# Altium schematic sheet WanderDrive_EtherCAT.SchDoc
size A2; Date: Not shown in title block; ApprovedBy: Not shown in title block; CheckedBy: Not shown in title block; Author: Not shown in title block; CompanyName: Not shown in title block; Engineer: Not shown in title block; Organization: Not shown in title block; Address1: Not shown in title block; Address2: Not shown in title block; Address3: Not shown in title block; Address4: Not shown in title block; DocumentNumber: 8; Revision: Use project parameter SCH_Rev; SheetNumber: 8; SheetTotal: 11; PageSetup: Record=PageOptions|CenterHorizontal=True|CenterVertical=True|PrintScale=1.00|XCorrection=1.00|YCorrection=1.00|PrintKind=0|BorderSize=5000000|LeftOffset=0|BottomOffset=0|Orientation=2|PaperLength=1000|PaperWidth=1000|Scale=100|PaperSource=15|PrintQuality=600|MediaType=1|DitherType=10|PaperKind=Letter|PrintScaleMode=1; CurrentTime: Not shown in title block; CurrentDate: Not shown in title block; Time: Not shown in title block; DocumentFullPathAndName: Not shown in title block; DocumentName: Not shown in title block; ModifiedDate: Not shown in title block; ImagePath: Not shown in title block
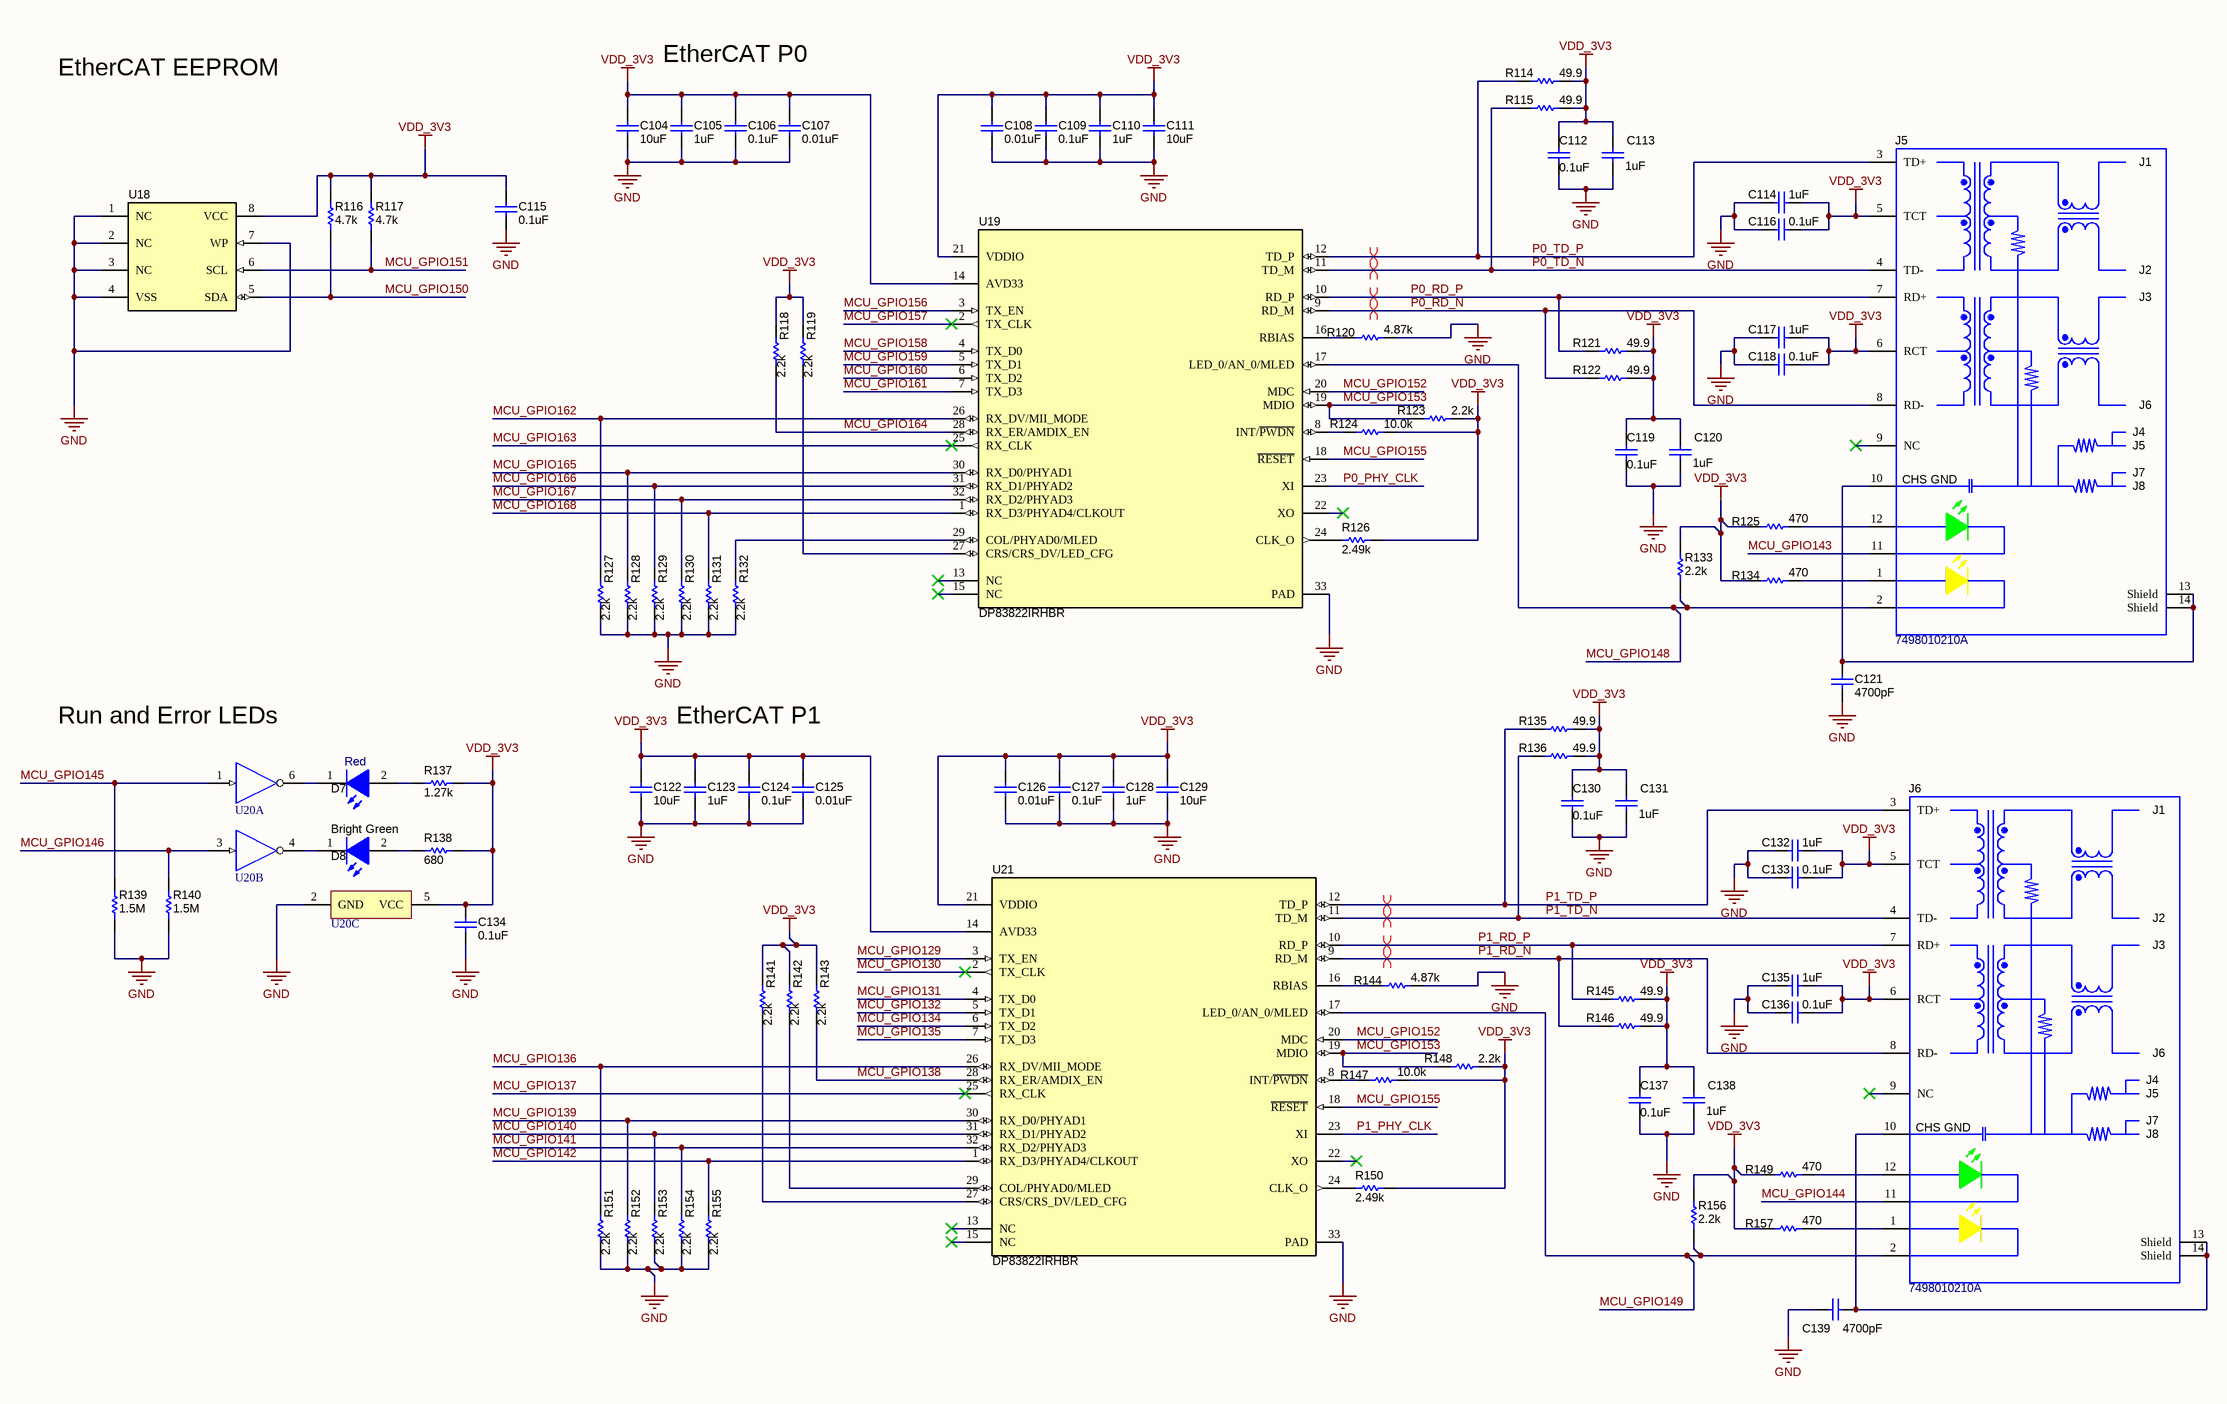
[diagram p0: WanderDrive_EtherCAT.SchDoc]

## Parts
C104  ValueDisplayed: 10uF  [0402]  (hidden comment: CL05A106MQ5NUNC)
C105  ValueDisplayed: 1uF  [0402]  (hidden comment: EMK105BJ105KVHF)
C106  ValueDisplayed: 0.1uF  [0402]  (hidden comment: LMK105BJ104KV-F)
C107  ValueDisplayed: 0.01uF  [0402]  (hidden comment: 885012205031)
C108  ValueDisplayed: 0.01uF  [0402]  (hidden comment: 885012205031)
C109  ValueDisplayed: 0.1uF  [0402]  (hidden comment: LMK105BJ104KV-F)
C110  ValueDisplayed: 1uF  [0402]  (hidden comment: EMK105BJ105KVHF)
C111  ValueDisplayed: 10uF  [0402]  (hidden comment: CL05A106MQ5NUNC)
C112  ValueDisplayed: 0.1uF  [0402]  (hidden comment: LMK105BJ104KV-F)
C113  ValueDisplayed: 1uF  [0402]  (hidden comment: EMK105BJ105KVHF)
C114  ValueDisplayed: 1uF  [0402]  (hidden comment: EMK105BJ105KVHF)
C115  ValueDisplayed: 0.1uF  [0402]  (hidden comment: CL05B104KP5NNNC)
C116  ValueDisplayed: 0.1uF  [0402]  (hidden comment: LMK105BJ104KV-F)
C117  ValueDisplayed: 1uF  [0402]  (hidden comment: EMK105BJ105KVHF)
C118  ValueDisplayed: 0.1uF  [0402]  (hidden comment: LMK105BJ104KV-F)
C119  ValueDisplayed: 0.1uF  [0402]  (hidden comment: LMK105BJ104KV-F)
C120  ValueDisplayed: 1uF  [0402]  (hidden comment: EMK105BJ105KVHF)
C121  ValueDisplayed: 4700pF  [1206]  (hidden comment: 12061C472KAT2A)
C122  ValueDisplayed: 10uF  [0402]  (hidden comment: CL05A106MQ5NUNC)
C123  ValueDisplayed: 1uF  [0402]  (hidden comment: EMK105BJ105KVHF)
C124  ValueDisplayed: 0.1uF  [0402]  (hidden comment: LMK105BJ104KV-F)
C125  ValueDisplayed: 0.01uF  [0402]  (hidden comment: 885012205031)
C126  ValueDisplayed: 0.01uF  [0402]  (hidden comment: 885012205031)
C127  ValueDisplayed: 0.1uF  [0402]  (hidden comment: LMK105BJ104KV-F)
C128  ValueDisplayed: 1uF  [0402]  (hidden comment: EMK105BJ105KVHF)
C129  ValueDisplayed: 10uF  [0402]  (hidden comment: CL05A106MQ5NUNC)
C130  ValueDisplayed: 0.1uF  [0402]  (hidden comment: LMK105BJ104KV-F)
C131  ValueDisplayed: 1uF  [0402]  (hidden comment: EMK105BJ105KVHF)
C132  ValueDisplayed: 1uF  [0402]  (hidden comment: EMK105BJ105KVHF)
C133  ValueDisplayed: 0.1uF  [0402]  (hidden comment: LMK105BJ104KV-F)
C134  ValueDisplayed: 0.1uF  [0402]  (hidden comment: CL05B104KP5NNNC)
C135  ValueDisplayed: 1uF  [0402]  (hidden comment: EMK105BJ105KVHF)
C136  ValueDisplayed: 0.1uF  [0402]  (hidden comment: LMK105BJ104KV-F)
C137  ValueDisplayed: 0.1uF  [0402]  (hidden comment: LMK105BJ104KV-F)
C138  ValueDisplayed: 1uF  [0402]  (hidden comment: EMK105BJ105KVHF)
C139  ValueDisplayed: 4700pF  [1206]  (hidden comment: 12061C472KAT2A)
D7  value Red  [WL-SMCW_RED_0805]  (hidden comment: 150080SS75000)
D8  value Bright Green  [WL-SMCW_Green_0805]  (hidden comment: 150080VS75000)
J5  7498010210A  [Wurth_7498010210A]
J6  7498010210A  [Wurth_7498010210A]
R114  ValueDisplayed: 49.9  [0402]  (hidden comment: RC0402FR-0749R9L)
R115  ValueDisplayed: 49.9  [0402]  (hidden comment: RC0402FR-0749R9L)
R116  ValueDisplayed: 4.7k  [0402]  (hidden comment: CRCW04024K70JNED)
R117  ValueDisplayed: 4.7k  [0402]  (hidden comment: CRCW04024K70JNED)
R118  ValueDisplayed: 2.2k  [0201]  (hidden comment: CRCW02012K20JNED)
R119  ValueDisplayed: 2.2k  [0201]  (hidden comment: CRCW02012K20JNED)
R120  ValueDisplayed: 4.87k  [0402]  (hidden comment: CRCW04024K87FKED)
R121  ValueDisplayed: 49.9  [0402]  (hidden comment: RC0402FR-0749R9L)
R122  ValueDisplayed: 49.9  [0402]  (hidden comment: RC0402FR-0749R9L)
R123  ValueDisplayed: 2.2k  [0402]  (hidden comment: CRCW04022K20JNED)
R124  ValueDisplayed: 10.0k  [0402]  (hidden comment: RC0402FR-0710KL)
R125  ValueDisplayed: 470  [0603]  (hidden comment: CRCW0603470RJNEA)
R126  ValueDisplayed: 2.49k  [0402]  (hidden comment: CRCW04022K49FKED)
R127  ValueDisplayed: 2.2k  [0201]  (hidden comment: CRCW02012K20JNED)
R128  ValueDisplayed: 2.2k  [0201]  (hidden comment: CRCW02012K20JNED)
R129  ValueDisplayed: 2.2k  [0201]  (hidden comment: CRCW02012K20JNED)
R130  ValueDisplayed: 2.2k  [0201]  (hidden comment: CRCW02012K20JNED)
R131  ValueDisplayed: 2.2k  [0201]  (hidden comment: CRCW02012K20JNED)
R132  ValueDisplayed: 2.2k  [0201]  (hidden comment: CRCW02012K20JNED)
R133  ValueDisplayed: 2.2k  [0402]  (hidden comment: CRCW04022K20JNED)
R134  ValueDisplayed: 470  [0603]  (hidden comment: CRCW0603470RJNEA)
R135  ValueDisplayed: 49.9  [0402]  (hidden comment: RC0402FR-0749R9L)
R136  ValueDisplayed: 49.9  [0402]  (hidden comment: RC0402FR-0749R9L)
R137  ValueDisplayed: 1.27k  [0402]  (hidden comment: CRCW04021K27FKED)
R138  ValueDisplayed: 680  [0402]  (hidden comment: CRCW0402680RJNED)
R139  ValueDisplayed: 1.5M  [0402]  (hidden comment: CRCW04021M50JNED)
R140  ValueDisplayed: 1.5M  [0402]  (hidden comment: CRCW04021M50JNED)
R141  ValueDisplayed: 2.2k  [0201]  (hidden comment: CRCW02012K20JNED)
R142  ValueDisplayed: 2.2k  [0201]  (hidden comment: CRCW02012K20JNED)
R143  ValueDisplayed: 2.2k  [0201]  (hidden comment: CRCW02012K20JNED)
R144  ValueDisplayed: 4.87k  [0402]  (hidden comment: CRCW04024K87FKED)
R145  ValueDisplayed: 49.9  [0402]  (hidden comment: RC0402FR-0749R9L)
R146  ValueDisplayed: 49.9  [0402]  (hidden comment: RC0402FR-0749R9L)
R147  ValueDisplayed: 10.0k  [0402]  (hidden comment: RC0402FR-0710KL)
R148  ValueDisplayed: 2.2k  [0402]  (hidden comment: CRCW04022K20JNED)
R149  ValueDisplayed: 470  [0603]  (hidden comment: CRCW0603470RJNEA)
R150  ValueDisplayed: 2.49k  [0402]  (hidden comment: CRCW04022K49FKED)
R151  ValueDisplayed: 2.2k  [0201]  (hidden comment: CRCW02012K20JNED)
R152  ValueDisplayed: 2.2k  [0201]  (hidden comment: CRCW02012K20JNED)
R153  ValueDisplayed: 2.2k  [0201]  (hidden comment: CRCW02012K20JNED)
R154  ValueDisplayed: 2.2k  [0201]  (hidden comment: CRCW02012K20JNED)
R155  ValueDisplayed: 2.2k  [0201]  (hidden comment: CRCW02012K20JNED)
R156  ValueDisplayed: 2.2k  [0402]  (hidden comment: CRCW04022K20JNED)
R157  ValueDisplayed: 470  [0603]  (hidden comment: CRCW0603470RJNEA)
U18  CAT24C16WI-GT3  [SOIC-8]  (value not drawn)
U19  DP83822IRHBR  [RHB0032B]
U20  SN74LVC2G06DBVR  [DBV0006A_N]  (value not drawn)  (parts A,B,C of 3)
U21  DP83822IRHBR  [RHB0032B]

## Nets
GND: C104.2 C105.2 C106.2 C107.2 C108.2 C109.2 C110.2 C111.2 C112.2 C113.2 C114.1 C115.2 C116.1 C117.1 C118.1 C119.2 C120.2 C121.1 C122.2 C123.2 C124.2 C125.2 C126.2 C127.2 C128.2 C129.2 C130.2 C131.2 C132.1 C133.1 C134.2 C135.1 C136.1 C137.2 C138.2 C139.1 R120.2 R127.1 R128.1 R129.1 R130.1 R131.1 R132.1 R139.2 R140.2 R144.2 R151.1 R152.1 R153.1 R154.1 R155.1 U18.1(NC) U18.2(NC) U18.3(NC) U18.4(VSS) U18.7(WP) U19.33(PAD) U20.2(GND) U21.33(PAD)
VDD_3V3: C104.1 C105.1 C106.1 C107.1 C108.1 C109.1 C110.1 C111.1 C112.1 C113.1 C114.2 C115.1 C116.2 C117.2 C118.2 C119.1 C120.1 C122.1 C123.1 C124.1 C125.1 C126.1 C127.1 C128.1 C129.1 C130.1 C131.1 C132.2 C133.2 C134.1 C135.2 C136.2 C137.1 C138.1 J5.5(TCT) J5.6(RCT) J6.5(TCT) J6.6(RCT) R114.2 R115.2 R116.2 R117.2 R118.2 R119.2 R121.2 R122.2 R123.1 R124.2 R125.1 R126.1 R133.2 R134.1 R135.2 R136.2 R137.2 R138.1 R141.2 R142.2 R143.2 R145.2 R146.2 R147.2 R148.1 R149.1 R150.1 R156.2 R157.1 U18.8(VCC) U19.14(AVD33) U19.21(VDDIO) U20.5(VCC) U21.14(AVD33) U21.21(VDDIO)
MCU_GPIO129: U21.3(TX_EN)
MCU_GPIO130: U21.2(TX_CLK)
MCU_GPIO131: U21.4(TX_D0)
MCU_GPIO132: U21.5(TX_D1)
MCU_GPIO134: U21.6(TX_D2)
MCU_GPIO135: U21.7(TX_D3)
MCU_GPIO136: R151.2 U21.26(RX_DV/MII_MODE)
MCU_GPIO137: U21.25(RX_CLK)
MCU_GPIO138: R143.1 U21.28(RX_ER/AMDIX_EN)
MCU_GPIO139: R152.2 U21.30(RX_D0/PHYAD1)
MCU_GPIO140: R153.2 U21.31(RX_D1/PHYAD2)
MCU_GPIO141: R154.2 U21.32(RX_D2/PHYAD3)
MCU_GPIO142: R155.2 U21.1(RX_D3/PHYAD4/CLKOUT)
MCU_GPIO143: J5.11(LEFT_LED_CATHODE)
MCU_GPIO144: J6.11(LEFT_LED_CATHODE)
MCU_GPIO145: R139.1 U20.1(1A)
MCU_GPIO146: R140.1 U20.3(2A)
MCU_GPIO148: J5.2(RIGHT_LED_CATHODE) R133.1 U19.17(LED_0/AN_0/MLED)
MCU_GPIO149: J6.2(RIGHT_LED_CATHODE) R156.1 U21.17(LED_0/AN_0/MLED)
MCU_GPIO150: R116.1 U18.5(SDA)
MCU_GPIO151: R117.1 U18.6(SCL)
MCU_GPIO152: U19.20(MDC) U21.20(MDC)
MCU_GPIO153: R123.2 R148.2 U19.19(MDIO) U21.19(MDIO)
MCU_GPIO155: U19.18(~{RESET}) U21.18(~{RESET})
MCU_GPIO156: U19.3(TX_EN)
MCU_GPIO157: U19.2(TX_CLK)
MCU_GPIO158: U19.4(TX_D0)
MCU_GPIO159: U19.5(TX_D1)
MCU_GPIO160: U19.6(TX_D2)
MCU_GPIO161: U19.7(TX_D3)
MCU_GPIO162: R127.2 U19.26(RX_DV/MII_MODE)
MCU_GPIO163: U19.25(RX_CLK)
MCU_GPIO164: R118.1 U19.28(RX_ER/AMDIX_EN)
MCU_GPIO165: R128.2 U19.30(RX_D0/PHYAD1)
MCU_GPIO166: R129.2 U19.31(RX_D1/PHYAD2)
MCU_GPIO167: R130.2 U19.32(RX_D2/PHYAD3)
MCU_GPIO168: R131.2 U19.1(RX_D3/PHYAD4/CLKOUT)
P0_PHY_CLK: U19.23(XI)
P0_RD_N: J5.8(RD-) R122.1 U19.9(RD_M)
P0_RD_P: J5.7(RD+) R121.1 U19.10(RD_P)
P0_TD_N: J5.4(TD-) R115.1 U19.11(TD_M)
P0_TD_P: J5.3(TD+) R114.1 U19.12(TD_P)
P1_PHY_CLK: U21.23(XI)
P1_RD_N: J6.8(RD-) R146.1 U21.9(RD_M)
P1_RD_P: J6.7(RD+) R145.1 U21.10(RD_P)
P1_TD_N: J6.4(TD-) R136.1 U21.11(TD_M)
P1_TD_P: J6.3(TD+) R135.1 U21.12(TD_P)
NetC121_2: C121.2 J5.10(CHS_GND) J5.13(Shield) J5.14(Shield)
NetC139_2: C139.2 J6.10(CHS_GND) J6.13(Shield) J6.14(Shield)
NetD7_1: D7.1(K) U20.6(1Y)
NetD7_2: D7.2(A) R137.1
NetD8_1: D8.1(K) U20.4(2Y)
NetD8_2: D8.2(A) R138.2
NetJ5_1: J5.1(RIGHT_LED_ANODE) R134.2
NetJ5_12: J5.12(LEFT_LED_ANODE) R125.2
NetJ6_1: J6.1(RIGHT_LED_ANODE) R157.2
NetJ6_12: J6.12(LEFT_LED_ANODE) R149.2
NetR119_1: R119.1 U19.27(CRS/CRS_DV/LED_CFG)
NetR120_1: R120.1 U19.16(RBIAS)
NetR124_1: R124.1 U19.8(INT/~{PWDN})
NetR126_2: R126.2 U19.24(CLK_O)
NetR132_2: R132.2 U19.29(COL/PHYAD0/MLED)
NetR141_1: R141.1 U21.27(CRS/CRS_DV/LED_CFG)
NetR142_1: R142.1 U21.29(COL/PHYAD0/MLED)
NetR144_1: R144.1 U21.16(RBIAS)
NetR147_1: R147.1 U21.8(INT/~{PWDN})
NetR150_2: R150.2 U21.24(CLK_O)

Not connected (* = marked no-connect by the designer): J5 9(NC)*; J6 9(NC)*; U19 13(NC)* 15(NC)* 22(XO)*; U21 13(NC)* 15(NC)* 22(XO)*

## Layout directives
differential pair: P0_RD_N, P0_RD_P, P0_TD_N, P0_TD_P, P1_RD_N, P1_RD_P, P1_TD_N, P1_TD_P

## Notes on the sheet
- EtherCAT EEPROM
- EtherCAT P0
- Run and Error LEDs
- EtherCAT P1
- Title
- Size:
- Date:
- File:
- A2
- Number:
- Time:
- Revision:
- Sheet
- of
- (in symbol CMP-0086350-1) J1; J2; J3; J6; J4; J7; J8; J5

## Library data of the parts
C104 C111 C122 C129 = CMP-0006340-2: CAP, CERM, 10 uF, 6.3 V, +/- 20%, X5R, 0402; Manufacturer: Samsung Electro-Mechanics; TaMin_C: -55°C; Polarized: N; SizeAreaWB_mm2: 3; Value1: Unknown; U/M: EA; Value: 10uF; TaMax_C: 85°C; SizeZ_mm: 0.6; SizeX_mm: 1; SizeY_mm: 0.5; Value2: 6.3V; Cap_F: 10µF; AEC Category: Q200; Publisher: Texas Instruments; TempCo: X5R; Published: 2008-06-19; RoHS: Y; MountType: SMT; PackageReference: 0402; Tolerance_%: 20%; Cap_Case: 0402; SizeArea_mm2: 0.5; CompType: Capacitor; LatestRevisionDate: 2017-03-09; PartNumber: CL05A106MQ5NUNC; AEC Qualified: ?; ComponentLink1Description: Datasheet link; Technology: Ceramic; ComponentLink1URL: http://www.samsungsem.com/servlet/DownloadServlet?dir=partnumber&num=&fileName=CL05A106MQ5NUNC.pdf
C105 C110 C113 C114 C117 C120 C123 C128 C131 C132 C135 C138 = CMP-0006347-2: CAP, CERM, 1 uF, 16 V, +/- 10%, X5R, 0402; Manufacturer: Taiyo Yuden; TaMin_C: -55°C; Polarized: N; SizeAreaWB_mm2: 3; Value1: Unknown; U/M: EA; Value: 1uF; TaMax_C: 85°C; SizeZ_mm: 0.6; SizeX_mm: 1; SizeY_mm: 0.5; Value2: 16V; Cap_F: 1µF; AEC Category: Q200; Supplier Part Number 2: 68X1293; Publisher: Texas Instruments; Supplier 2: Newark; TempCo: X5R; Published: 2008-06-19; RoHS: Y; MountType: SMT; Supplier 1: Digi-Key; PackageReference: 0402; Tolerance_%: 10%; Cap_Case: 0402; SizeArea_mm2: 0.5; CompType: Capacitor; LatestRevisionDate: 2017-03-09; PartNumber: EMK105BJ105KVHF; AEC Qualified: ?; ComponentLink1Description: Datasheet link; Supplier Part Number 1: 587-3709-2-ND; Technology: Ceramic; ComponentLink1URL: http://www.yuden.co.jp/ut/product/category/capacitor/EMK105BJ105KVHF_SS.pdf
C106 C109 C112 C116 C118 C119 C124 C127 C130 C133 C136 C137 = CMP-0064930-2: CAP, CERM, 0.1 uF, 10 V,+/- 10%, X5R, 0402; Manufacturer: Taiyo Yuden; TaMin_C: -55°C; Polarized: N; SizeAreaWB_mm2: 3; Value1: Unknown; U/M: EA; Value: 0.1uF; TaMax_C: 85°C; SizeZ_mm: 0.6; SizeX_mm: 1; SizeY_mm: 0.5; Value2: 10V; Cap_F: 100nF; AEC Category: Q200; Supplier Part Number 2: 86H5618; Publisher: Texas Instruments; Supplier 2: Newark; Supplier Part Number 3: 963-LMK105BJ104KV-F; TempCo: X5R; Supplier 3: Mouser; Published: 2008-06-19; RoHS: Y; MountType: SMT; Supplier 1: Digi-Key; PackageReference: 0402; Tolerance_%: 10%; Cap_Case: 0402; SizeArea_mm2: 0.5; CompType: Capacitor; LatestRevisionDate: 2017-06-05; PartNumber: LMK105BJ104KV-F; AEC Qualified: N; ComponentLink1Description: Datasheet link; AEC Grade: N/A; Supplier Part Number 1: 587-1227-1-ND; Technology: Ceramic; ComponentLink1URL: http://ds.yuden.co.jp/TYCOMPAS/ut/detail.do?productNo=LMK105BJ104KV-F&fileName=LMK105BJ104KV-F_SS&mode=specSheetDownload; VDC_V: 10V
C107 C108 C125 C126 = CMP-0006227-2: CAP, CERM, 0.01 uF, 16 V, +/- 10%, X7R, 0402; Manufacturer: Wurth Elektronik; TaMin_C: -55°C; Polarized: N; SizeAreaWB_mm2: 3; Value1: Unknown; U/M: EA; Value: 0.01uF; TaMax_C: 125°C; SizeZ_mm: 0.6; SizeX_mm: 1; SizeY_mm: 0.5; Value2: 16V; Cap_F: 10nF; AEC Category: Q200; Publisher: Texas Instruments; TempCo: X7R; Published: 2008-06-19; RoHS: Y; MountType: SMT; Supplier 1: Mouser; PackageReference: 0402; Tolerance_%: 10%; Cap_Case: 0402; SizeArea_mm2: 0.5; CompType: Capacitor; LatestRevisionDate: 2017-03-09; PartNumber: 885012205031; AEC Qualified: N; ComponentLink1Description: Datasheet link; AEC Grade: N/A; Supplier Part Number 1: 710-885012205031; Technology: Ceramic; ComponentLink1URL: http://katalog.we-online.de/pbs/datasheet/885012205031.pdf
C115 C134 = CMP-0006343-2: CAP, CERM, 0.1 uF, 10 V, +/- 10%, X7R, 0402; Manufacturer: Samsung Electro-Mechanics; Polarized: N; Value: 0.1uF; U/M: EA; Cap_F: 100nF; Value1: Unknown; VDC_V: 10V; TaMin_C: -55°C; TaMax_C: 125°C; AEC Category: Q200; SizeArea_mm2: 0.5; SizeAreaWB_mm2: 3; SizeX_mm: 1; SizeZ_mm: 0.6; CompType: Capacitor; PartNumber: CL05B104KP5NNNC; PackageReference: 0402; RoHS: Y; Tolerance_%: 10%; Value2: 10V; MountType: SMT; Technology: Ceramic; TempCo: X7R; Cap_Case: 0402; Published: 2008-06-19; Publisher: Texas Instruments; LatestRevisionDate: 2017-03-09; ComponentLink1Description: Datasheet link; ComponentLink1URL: http://www.samsungsem.com/kr/front/downloadcms.do?path=/kr/support/product-search/mlcc/__icsFiles/afieldfile/2014/11/05&fileName=S_CL05B104KP5NNNC.pdf; AEC Qualified: N; AEC Grade: N/A; SizeY_mm: 0.5
C121 C139 = CMP-0008501-2: CAP, CERM, 4700 pF, 100 V, +/- 10%, X7R, 1206; Manufacturer: AVX; TaMin_C: -55°C; ESR_ohm: 1.78d; Polarized: N; SizeAreaWB_mm2: 10.92; Value1: 0.178 ohm; U/M: EA; Value: 4700pF; TaMax_C: 125°C; SizeZ_mm: 1.35; SizeX_mm: 3.2; SizeY_mm: 1.6; Value2: 100V; SizeArea_mm2: 5.12; Cap_F: 4.7nF; AEC Category: Q200; Supplier Part Number 2: 96M1479; Publisher: Texas Instruments; Supplier 2: Newark; Supplier Part Number 3: 581-12061C472K; TempCo: X7R; Supplier 3: Mouser; Published: 2008-06-19; RoHS: Y; MountType: SMT; Supplier 1: Digi-Key; PackageReference: 1206; Tolerance_%: 10%; Cap_Case: 1206; CompType: Capacitor; LatestRevisionDate: 2017-03-09; PartNumber: 12061C472KAT2A; AEC Qualified: N; ComponentLink1Description: Datasheet link; AEC Grade: N/A; Supplier Part Number 1: 478-1521-1-ND; Technology: Ceramic; ComponentLink1URL: http://datasheets.avx.com/X7RDielectric.pdf
D7 = CMP-0002951-3: LED, Red, SMD; Manufacturer: Wurth Elektronik; Type: AlInGaP; Vf_V: 1.9V; Io_A: 30mA; Vr_V: 5V; Ir_A: 25µA; Tjmax_C: 85°C; Power_TotalModule: 72mW; Value1: 0.072W; Angle: 140; PartNumber: 150080SS75000; PackageReference: LED_0805; RoHS: Y; CompType: LED; MountType: SMT; Value2: 1.9V; Color: Red; ComponentLink1URL: http://katalog.we-online.de/led/datasheet/150080SS75000.pdf; ComponentLink1Description: Datasheet link
D8 = CMP-0002960-2: LED, Bright Green, SMD; Manufacturer: Wurth Elektronik; Type: AlInGaP; Vf_V: 2V; Io_A: 20mA; Vr_V: 5V; Tjmax_C: 85°C; Power_TotalModule: 72mW; Value1: 0.072W; Angle: 140; U/M: EA; PartNumber: 150080VS75000; PackageReference: LED_0805; RoHS: Y; CompType: LED; MountType: SMT; Value2: 2V; Color: Bright Green; Published: 2008-07-11; Publisher: Texas Instruments; ComponentLink1URL: http://katalog.we-online.de/led/datasheet/150080VS75000.pdf; ComponentLink1Description: Datasheet link; LatestRevisionDate: 2017-03-09; Supplier 1: Digi-Key; Supplier Part Number 1: 732-4986-1-ND; Supplier 2: Newark; Supplier Part Number 2: 95W3803; Supplier 3: Mouser; Supplier Part Number 3: 710-150080VS75000
J5 J6 = CMP-0086350-1: Connector, RJ45, 1x1, Gold, R/A, SMT; Manufacturer: Wurth Elektronik; Row_Count: 1; Gender: Female; ComponentLink1URL: https://sps16.itg.ti.com/sites/KMS/crossdivteams/altium/docs/ComponentDatasheets/7498010210A.pdf; ContactFinish: Gold; MountType: SMT; PinCount: 12; RoHS: Y; PackageReference: Connector, RJ45, 1x1, Gold, R/A, SMT; ComponentLink1Description: Datasheet URL; Orientation: R/A; CompType: RJ45; PartNumber: 7498010210A
R114 R115 R121 R122 R135 R136 R145 R146 = CMP-0026738-1: RES, 49.9, 1%, 0.063 W, 0402; Manufacturer: Yageo America; Power_W: 63mW; TempCo: 100 ppm/C; Value_Code: 49R9; U/M: EA; Value: 49.9; EIA_Code: E96; SizeX_mm: 1; SizeY_mm: 0.5; SizeZ_mm: 0.6; Value2: 0.063W; AEC Qualified: N; VDC_V: 50V; AEC Category: Q200; ComponentLink1URL: http://www.yageo.com/documents/recent/PYu-RC_Group_51_RoHS_L_1.pdf; Supplier Part Number 2: 67R9942; Publisher: Texas Instruments; Supplier 2: Newark; Supplier Part Number 3: 603-RC0402FR-0749R9L; Supplier 3: Mouser; Published: 2008-06-26; RoHS: Y; Value1: 1%; MountType: SMT; Supplier 1: Digi-Key; PackageReference: 0402; Tolerance_%: 1%; Res_ohm: 49.9; SizeArea_mm2: 0.5; CompType: Resistor; LatestRevisionDate: 2017-03-09; PartNumber: RC0402FR-0749R9L; ComponentLink1Description: Datasheet link; AEC Grade: N/A; Supplier Part Number 1: 311-49.9LRCT-ND; Technology: Thick Film
R116 R117 = CMP-0026938-5: RES, 4.7 k, 5%, 0.063 W, AEC-Q200 Grade 0, 0402; Manufacturer: Vishay-Dale; Power_W: 63mW; TempCo: 200 ppm/C; Value_Code: 4k70; Value: 4.7k; EIA_Code: E24; SizeX_mm: 1; SizeY_mm: 0.5; SizeZ_mm: 0.6; Value2: 0.063W; AEC Qualified: Y; VDC_V: 50V; AEC Category: Q200; AEC Grade: 0; Supplier Part Number 2: 59M6733; Supplier 2: Newark; Supplier Part Number 3: 71-CRCW0402J-4.7K-E3; Supplier 3: Mouser; RoHS: E; Value1: 5%; MountType: SMT; Supplier 1: Digi-Key; PackageReference: 0402; Tolerance_%: 5%; Res_ohm: 4.7k; SizeArea_mm2: 0.5; CompType: Resistor; PartNumber: CRCW04024K70JNED; ComponentLink1Description: Datasheet link; Supplier Part Number 1: 541-4.7KJCT-ND; Technology: Thick Film; ComponentLink1URL: http://www.vishay.com/docs/20035/dcrcwe3.pdf
R118 R119 R127-R132 R141-R143 R151-R155 = CMP-0027010-2: RES, 2.2 k, 5%, 0.05 W, 0201; Manufacturer: Vishay-Dale; Power_W: 50mW; TempCo: 200 ppm/C; Value_Code: 2k20; Value: 2.2k; EIA_Code: E24; SizeX_mm: 0.6; SizeY_mm: 0.3; SizeZ_mm: 0.26; Value2: 0.05W; SizeArea_mm2: 0.18; AEC Qualified: N; VDC_V: 30V; AEC Category: Q200; ComponentLink1URL: http://www.vishay.com/docs/20052/crcw0201e3.pdf; Supplier Part Number 2: 48P7324; Supplier 2: Newark; Supplier Part Number 3: 71-CRCW02012K20JNED; Supplier 3: Mouser; RoHS: E; Value1: 5%; MountType: SMT; Supplier 1: Digi-Key; PackageReference: 0201; Tolerance_%: 5%; Res_ohm: 2.2k; CompType: Resistor; PartNumber: CRCW02012K20JNED; ComponentLink1Description: Datasheet link; AEC Grade: N/A; Supplier Part Number 1: 541-2.2KAGCT-ND; Technology: Thick Film
R120 R144 = CMP-0026413-2: RES, 4.87 k, 1%, 0.063 W, AEC-Q200 Grade 0, 0402; Manufacturer: Vishay-Dale; Power_W: 63mW; TempCo: 100 ppm/C; Value_Code: 4k87; Value: 4.87k; EIA_Code: E96; SizeX_mm: 1; SizeY_mm: 0.5; SizeZ_mm: 0.6; Value2: 0.063W; AEC Qualified: Y; VDC_V: 50V; AEC Category: Q200; AEC Grade: 0; ComponentLink1URL: http://www.vishay.com/docs/20035/dcrcwe3.pdf; Supplier Part Number 2: 52K7047; Supplier 2: Newark; Supplier Part Number 3: 71-CRCW0402-4.87K-E3; Supplier 3: Mouser; RoHS: E; Value1: 1%; MountType: SMT; Supplier 1: Digi-Key; PackageReference: 0402; Tolerance_%: 1%; Res_ohm: 4.87k; SizeArea_mm2: 0.5; CompType: Resistor; PartNumber: CRCW04024K87FKED; ComponentLink1Description: Datasheet link; Supplier Part Number 1: 541-4.87KLCT-ND; Technology: Thick Film
R123 R133 R148 R156 = CMP-0026890-5: RES, 2.2 k, 5%, 0.063 W, AEC-Q200 Grade 0, 0402; Manufacturer: Vishay-Dale; Power_W: 63mW; TempCo: 200 ppm/C; Value_Code: 2k20; Value: 2.2k; EIA_Code: E24; SizeX_mm: 1; SizeY_mm: 0.5; SizeZ_mm: 0.6; Value2: 0.063W; AEC Qualified: Y; VDC_V: 50V; AEC Category: Q200; AEC Grade: 0; Supplier Part Number 2: 59M6710; Supplier 2: Newark; Supplier Part Number 3: 71-CRCW0402J-2.2K-E3; Supplier 3: Mouser; RoHS: E; Value1: 5%; MountType: SMT; Supplier 1: Digi-Key; PackageReference: 0402; Tolerance_%: 5%; Res_ohm: 2.2k; SizeArea_mm2: 0.5; CompType: Resistor; PartNumber: CRCW04022K20JNED; ComponentLink1Description: Datasheet link; Supplier Part Number 1: 541-2.2KJCT-ND; Technology: Thick Film; ComponentLink1URL: http://www.vishay.com/docs/20035/dcrcwe3.pdf
R124 R147 = CMP-0078669-1: RES, 10.0 k, 1%, 0.063 W, 0402; Manufacturer: Yageo America; Power_W: 63mW; Green_Lifecycle: Active; TempCo: 100 ppm/C; Value_Code: 10k0; Green_REACh: Passed; Value: 10.0k; EIA_Code: E96; Res_ohm: 10k; SizeX_mm: 1; SizeY_mm: 0.5; SizeZ_mm: 0.6; Value2: 0.063W; AEC Qualified: N; AEC Category: Q200; ComponentLink1URL: http://www.yageo.com/documents/recent/PYu-RC_Group_51_RoHS_L_8.pdf; Supplier Part Number 2: 98K7499; Supplier 2: Newark; Supplier Part Number 3: 603-RC0402FR-0710KL; Supplier 3: Mouser; RoHS: Y; Value1: 1%; MountType: SMT; Green_EU RoHS-2: Passed; Supplier 1: Digi-Key; Green_EU RoHS: Passed with Exemption; PackageReference: 0402; Tolerance_%: 1%; SizeArea_mm2: 0.5; CompType: Resistor; PartNumber: RC0402FR-0710KL; ComponentLink1Description: Datasheet link; AEC Grade: N/A; Supplier Part Number 1: 311-10.0KLRCT-ND; Technology: Thick Film
R125 R134 R149 R157 = CMP-0025813-4: RES, 470, 5%, 0.1 W, AEC-Q200 Grade 0, 0603; Manufacturer: Vishay-Dale; Power_W: 100mW; TempCo: 200 ppm/C; Value_Code: 470R; Value: 470; EIA_Code: E24; SizeX_mm: 1.6; SizeY_mm: 0.8; SizeZ_mm: 1; Value2: 0.1W; SizeArea_mm2: 1.28; AEC Qualified: Y; VDC_V: 75V; AEC Category: Q200; AEC Grade: 0; Supplier Part Number 2: 59M6817; Supplier 2: Newark; Supplier Part Number 3: 71-CRCW0603J-470-E3; Supplier 3: Mouser; RoHS: E; Value1: 5%; MountType: SMT; Supplier 1: Digi-Key; PackageReference: 0603; Tolerance_%: 5%; Res_ohm: 470; CompType: Resistor; PartNumber: CRCW0603470RJNEA; ComponentLink1Description: Datasheet link; Supplier Part Number 1: 541-470GCT-ND; Technology: Thick Film; ComponentLink1URL: http://www.vishay.com/docs/20035/dcrcwe3.pdf
R126 R150 = CMP-0026237-2: RES, 2.49 k, 1%, 0.063 W, AEC-Q200 Grade 0, 0402; Manufacturer: Vishay-Dale; Power_W: 63mW; TempCo: 100 ppm/C; Value_Code: 2k49; Value: 2.49k; EIA_Code: E96; SizeX_mm: 1; SizeY_mm: 0.5; SizeZ_mm: 0.6; Value2: 0.063W; AEC Qualified: Y; VDC_V: 50V; AEC Category: Q200; AEC Grade: 0; ComponentLink1URL: http://www.vishay.com/docs/20035/dcrcwe3.pdf; Supplier Part Number 2: 52K6803; Supplier 2: Newark; Supplier Part Number 3: 71-CRCW0402-2.49K-E3; Supplier 3: Mouser; RoHS: E; Value1: 1%; MountType: SMT; Supplier 1: Digi-Key; PackageReference: 0402; Tolerance_%: 1%; Res_ohm: 2.49k; SizeArea_mm2: 0.5; CompType: Resistor; PartNumber: CRCW04022K49FKED; ComponentLink1Description: Datasheet link; Supplier Part Number 1: 541-2.49KLCT-ND; Technology: Thick Film
R137 = CMP-0026081-3: RES, 1.27 k, 1%, 0.063 W, AEC-Q200 Grade 0, 0402; Manufacturer: Vishay-Dale; Power_W: 63mW; TempCo: 100 ppm/C; Value_Code: 1k27; Value: 1.27k; EIA_Code: E96; SizeX_mm: 1; SizeY_mm: 0.5; SizeZ_mm: 0.6; Value2: 0.063W; AEC Qualified: Y; VDC_V: 50V; AEC Category: Q200; AEC Grade: 0; Supplier Part Number 2: 52K6562; Supplier 2: Newark; Supplier Part Number 3: 71-CRCW0402-1.27K-E3; Supplier 3: Mouser; RoHS: E; Value1: 1%; MountType: SMT; Supplier 1: Digi-Key; PackageReference: 0402; Tolerance_%: 1%; Res_ohm: 1.27k; SizeArea_mm2: 0.5; CompType: Resistor; PartNumber: CRCW04021K27FKED; ComponentLink1Description: Datasheet link; Supplier Part Number 1: 541-1.27KLCT-ND; Technology: Thick Film; ComponentLink1URL: http://www.vishay.com/docs/20035/dcrcwe3.pdf
R138 = CMP-0026962-3: RES, 680, 5%, 0.063 W, AEC-Q200 Grade 0, 0402; Manufacturer: Vishay-Dale; Value: 680; Value_Code: 680R; Power_W: 63mW; Value2: 0.063W; VDC_V: 50V; TempCo: 200 ppm/C; EIA_Code: E24; AEC Category: Q200; AEC Qualified: Y; AEC Grade: 0; SizeArea_mm2: 0.5; SizeX_mm: 1; SizeZ_mm: 0.6; CompType: Resistor; PartNumber: CRCW0402680RJNED; PackageReference: 0402; RoHS: E; Res_ohm: 680; Tolerance_%: 5%; Value1: 5%; MountType: SMT; Technology: Thick Film; ComponentLink1Description: Datasheet link; ComponentLink1URL: http://www.vishay.com/docs/20035/dcrcwe3.pdf; Supplier 1: Digi-Key; Supplier Part Number 1: 541-680JCT-ND; Supplier 2: Newark; Supplier Part Number 2: 59M6744; Supplier 3: Mouser; Supplier Part Number 3: 71-CRCW0402J-680-E3; SizeY_mm: 0.5
R139 R140 = CMP-0026863-2: RES, 1.5 M, 5%, 0.063 W, AEC-Q200 Grade 0, 0402; Manufacturer: Vishay-Dale; Power_W: 63mW; TempCo: 200 ppm/C; Value_Code: 1M50; Value: 1.5Meg; EIA_Code: E24; SizeX_mm: 1; SizeY_mm: 0.5; SizeZ_mm: 0.6; Value2: 0.063W; AEC Qualified: Y; VDC_V: 50V; AEC Category: Q200; AEC Grade: 0; ComponentLink1URL: http://www.vishay.com/docs/20035/dcrcwe3.pdf; Supplier Part Number 2: 71-CRCW04021M50JNED; Supplier 2: Mouser; RoHS: E; Value1: 5%; MountType: SMT; Supplier 1: Digi-Key; PackageReference: 0402; Tolerance_%: 5%; Res_ohm: 1.5M; SizeArea_mm2: 0.5; CompType: Resistor; PartNumber: CRCW04021M50JNED; ComponentLink1Description: Datasheet link; Supplier Part Number 1: 541-1.5MJCT-ND; Technology: Thick Film
U18 = CMP-0082059-1: 16 Kb I2C EEPROM Serial, SOIC-8; Manufacturer: ON Semiconductor; SizeArea_mm2: 29.351; SizeAreaWB_mm2: 55.131; SizeY_mm: 4.9; SizeZ_mm: 1.75; SizeX_mm: 5.99; PartNumber: CAT24C16WI-GT3; Supplier Part Number 2: 23AC2979; Supplier 3: Mouser; PackageReference: SOIC-8; Supplier Part Number 1: CAT24C16WI-GT3CT-ND; ComponentLink1Description: Datasheet URL; MountType: SMT; ComponentLink1URL: https://www.onsemi.com/pub/Collateral/CAT24C01-D.PDF; Supplier 1: Digi-Key; RoHS: Y; Supplier 2: Newark; Supplier Part Number 3: 698-CAT24C16WI-GT3
U19 U21 = CMP-0076010-3: Robust, Low Power 10/100 Ethernet Physical Layer Transceiver, RHB0032B (VQFN-32); Alternate PartNumber: DP83822IRHBT; Manufacturer: Texas Instruments; SizeZ_mm: 1.0; SizeX_mm: 5.0; SizeArea_mm2: 25.0; CompType: IC; SizeAreaWB_mm2: 49.0; AEC Category: Q200; AEC Qualified: N; ComponentLink1URL: http://www.ti.com/lit/ds/symlink/dp83822i.pdf; PackageDescription: VQFN-32; SizeY_mm: 5.0; PackageReference: RHB0032B; RoHS: Y; PartNumber: DP83822IRHBR; ComponentLink1Description: Datasheet Link; MountType: SMT; Alternate Manufacturer: Texas Instruments; ComponentLink2Description: ComponentLink2Description; ComponentLink2URL: http://www.ti.com/product/dp83822i
U20 = CMP-0051777-1: Dual Inverter Buffer/Driver with Open-Drain Output, DBV0006A, LARGE T&R; Manufacturer: Texas Instruments; Schmitt Trigger: No; Logic: Inverting; F @ Nom Voltage(Max)(Mhz): 150; VCC(Max)(V): 5.5; Rating: Catalog; Sub-Family: Inverting Buffer/Driver; Technology Family: LVC; VCC(Min)(V): 1.65; Voltage(Nom)(V): 1.8,2.5,3.3,5; Output Drive (IOL/IOH)(Max)(mA): 32/-32; Output Type: CMOS; ICC @ Nom Voltage(Max)(mA): 0.01; Bits(#): 2; tpd @ Nom Voltage(Max)(ns): 8.2,4.4,3.9,3.4; Input Type: CMOS/TTL; DatasheetVersion: SCES307I; Generic Part Number: SN74LVC2G06; 3-State Output: No; PackageReference: DBV0006A; Operating Temperature Range(C): -40 to 125,-40 to 85; PartId: 1; PartNumber: SN74LVC2G06DBVR